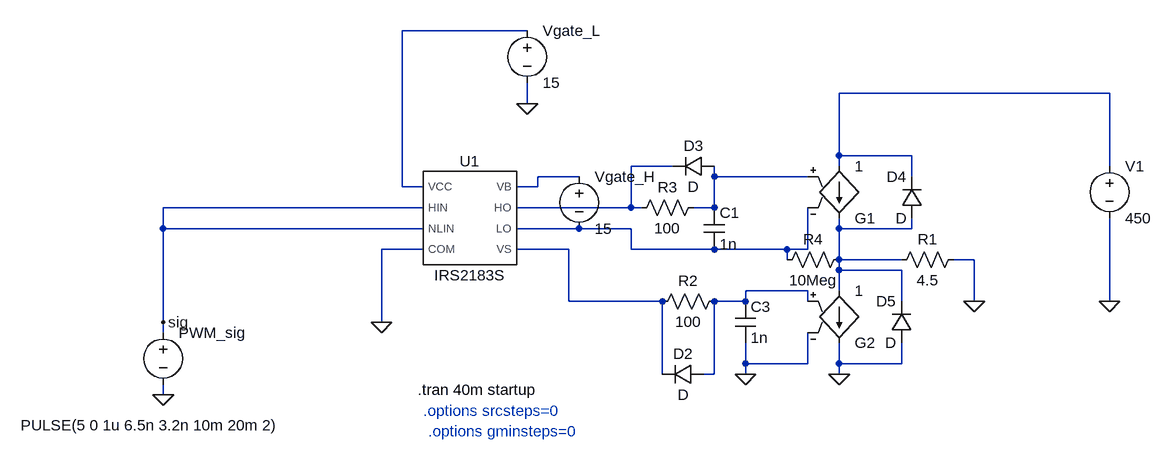
[diagram p0: schematic Si_driver_power_consumption.asc]
Si_driver_power_consumption.asc, the LTspice schematic file:
Version 4.1
SHEET 1 1284 816
WIRE 192 -112 0 -112
WIRE 1088 -16 672 -16
WIRE 192 0 192 -32
WIRE 672 80 672 -16
WIRE 784 80 672 80
WIRE 416 96 352 96
WIRE 672 96 672 80
WIRE 1088 96 1088 -16
WIRE 272 112 208 112
WIRE 480 112 480 96
WIRE 624 112 480 112
WIRE 784 112 784 80
WIRE 0 128 0 -112
WIRE 32 128 0 128
WIRE 208 128 208 112
WIRE 208 128 176 128
WIRE 32 160 -368 160
WIRE 352 160 352 96
WIRE 352 160 176 160
WIRE 368 160 352 160
WIRE 480 160 480 112
WIRE 480 160 448 160
WIRE -368 192 -368 160
WIRE 32 192 -368 192
WIRE 272 192 176 192
WIRE 352 192 272 192
WIRE 672 192 672 176
WIRE 784 192 784 176
WIRE 784 192 672 192
WIRE 32 224 -32 224
WIRE 256 224 176 224
WIRE 352 224 352 192
WIRE 480 224 352 224
WIRE 592 224 480 224
WIRE 624 224 624 160
WIRE 624 224 592 224
WIRE 592 240 592 224
WIRE 672 240 672 192
WIRE 768 240 672 240
WIRE 880 240 848 240
WIRE 672 256 672 240
WIRE 768 256 672 256
WIRE 624 288 528 288
WIRE 672 288 672 256
WIRE 256 304 256 224
WIRE 400 304 256 304
WIRE 528 304 528 288
WIRE 528 304 480 304
WIRE 624 304 624 288
WIRE 768 304 768 256
WIRE 880 304 880 240
WIRE 1088 304 1088 176
WIRE -368 336 -368 192
WIRE -32 336 -32 224
WIRE -368 352 -368 336
WIRE 528 400 528 368
WIRE 624 400 624 352
WIRE 624 400 528 400
WIRE 672 400 672 368
WIRE 768 400 768 368
WIRE 768 400 672 400
WIRE 400 416 400 304
WIRE 480 416 480 304
WIRE 480 416 464 416
WIRE 528 416 528 400
WIRE 672 416 672 400
WIRE -368 448 -368 432
FLAG 192 0 0
FLAG -368 448 0
FLAG -32 336 0
FLAG -368 336 sig
FLAG 672 416 0
FLAG 528 416 0
FLAG 880 304 0
FLAG 1088 304 0
SYMBOL voltage -368 336 R0
WINDOW 3 -219 159 Left 2
WINDOW 123 0 0 Left 0
WINDOW 39 0 0 Left 0
SYMATTR Value PULSE(5 0 1u 6.5n 3.2n 10m 20m 2)
SYMATTR InstName PWM_sig
SYMBOL voltage 192 -128 R0
WINDOW 123 0 0 Left 0
WINDOW 39 0 0 Left 0
SYMATTR InstName Vgate_L
SYMATTR Value 15
SYMBOL IRS2183S 96 176 R0
SYMATTR InstName U1
SYMBOL voltage 1088 80 R0
WINDOW 123 0 0 Left 0
WINDOW 39 0 0 Left 0
SYMATTR InstName V1
SYMATTR Value 450
SYMBOL res 864 224 R90
WINDOW 0 0 56 VBottom 2
WINDOW 3 32 56 VTop 2
SYMATTR InstName R1
SYMATTR Value 4.5
SYMBOL res 496 288 R90
WINDOW 0 0 56 VBottom 2
WINDOW 3 32 56 VTop 2
SYMATTR InstName R2
SYMATTR Value 100
SYMBOL diode 464 400 R90
WINDOW 0 0 32 VBottom 2
WINDOW 3 32 32 VTop 2
SYMATTR InstName D2
SYMBOL diode 480 80 R90
WINDOW 0 0 32 VBottom 2
WINDOW 3 32 32 VTop 2
SYMATTR InstName D3
SYMBOL res 464 144 R90
WINDOW 0 0 56 VBottom 2
WINDOW 3 32 56 VTop 2
SYMATTR InstName R3
SYMATTR Value 100
SYMBOL cap 464 160 R0
SYMATTR InstName C1
SYMATTR Value 1n
SYMBOL cap 512 304 R0
SYMATTR InstName C3
SYMATTR Value 1n
SYMBOL g2 672 192 M180
SYMATTR InstName G1
SYMATTR Value 1
SYMBOL g2 672 384 M180
SYMATTR InstName G2
SYMATTR Value 1
SYMBOL diode 800 176 R180
WINDOW 0 24 64 Left 2
WINDOW 3 24 0 Left 2
SYMATTR InstName D4
SYMBOL diode 784 368 R180
WINDOW 0 24 64 Left 2
WINDOW 3 24 0 Left 2
SYMATTR InstName D5
SYMBOL voltage 272 96 R0
WINDOW 123 0 0 Left 0
WINDOW 39 0 0 Left 0
SYMATTR InstName Vgate_H
SYMATTR Value 15
SYMBOL res 688 224 R90
WINDOW 0 0 56 VBottom 2
WINDOW 3 32 56 VTop 2
SYMATTR InstName R4
SYMATTR Value 10Meg
TEXT 24 440 Left 2 !.tran 40m startup
TEXT 32 472 Left 2 ;.options srcsteps=0
TEXT 40 504 Left 2 ;.options gminsteps=0

The netlist it stands for:
* Si_driver_power_consumption.asc
V§PWM_sig sig 0 PULSE(5 0 1u 6.5n 3.2n 10m 20m 2)
Vgate_L N001 0 15
X§U1 N006 N003 0 sig sig N001 N004 N008 IRS2183S  ; pins LO HO COM HIN NLIN VCC VB VS
V1 N002 0 450
R1 0 N007 4.5
R2 N009 N008 100
D2 N009 N008 D
D3 N005 N003 D
R3 N005 N003 100
C1 N005 N006 1n
C3 N009 0 1n
G1 N002 N007 N005 N006 1
G2 N007 0 N009 0 1
D4 N007 N002 D
D5 0 N007 D
Vgate_H N004 N006 15
R4 N007 N006 10Meg
.model D D
.lib standard.dio
.tran 40m startup
* .options srcsteps=0
* .options gminsteps=0
.lib IRS2183S.lib
.backanno
.end